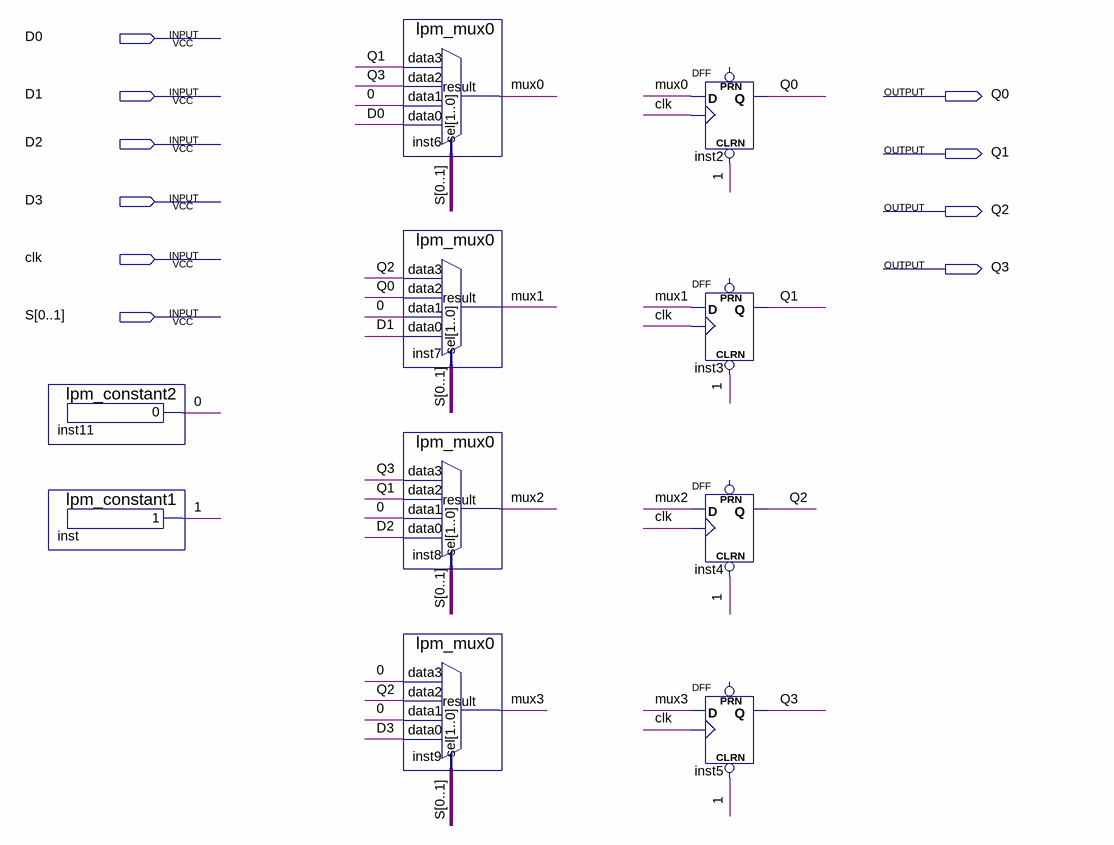
[diagram p0: schematic sheet]
// Quartus schematic lab5_2.bdf as structural Verilog: 10 symbols, 10 pins
module lab5_2 (
  input  D0,
  input  D1,
  input  D2,
  input  D3,
  input  clk,
  input  [0:1] S,
  output Q0,
  output Q1,
  output Q2,
  output Q3
);

  wire \0 , \1 , mux0, mux1, mux2, mux3;

  lpm_constant2 inst11 (.result(\0 ));
  lpm_constant1 inst (.result(\1 ));
  lpm_mux0 inst6 (.data3(Q1), .data2(Q3), .data1(\0 ), .data0(D0), .sel(S), .result(mux0));
  lpm_mux0 inst7 (.data3(Q2), .data2(Q0), .data1(\0 ), .data0(D1), .sel(S), .result(mux1));
  lpm_mux0 inst8 (.data3(Q3), .data2(Q1), .data1(\0 ), .data0(D2), .sel(S), .result(mux2));
  lpm_mux0 inst9 (.data3(\0 ), .data2(Q2), .data1(\0 ), .data0(D3), .sel(S), .result(mux3));
  DFF inst2 (.CLRN(\1 ), .CLK(clk), .D(mux0), .Q(Q0));  // open: PRN
  DFF inst3 (.CLRN(\1 ), .CLK(clk), .D(mux1), .Q(Q1));  // open: PRN
  DFF inst4 (.CLRN(\1 ), .CLK(clk), .D(mux2), .Q(Q2));  // open: PRN
  DFF inst5 (.CLRN(\1 ), .CLK(clk), .D(mux3), .Q(Q3));  // open: PRN
endmodule
